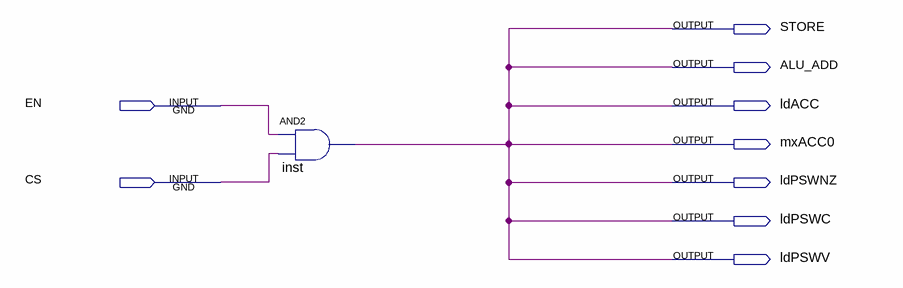
[diagram p0: schematic sheet]
// Quartus schematic ADD.bdf as structural Verilog: 1 symbols, 9 pins
module ADD (
  input  EN,
  input  CS,
  output STORE,
  output ALU_ADD,
  output ldACC,
  output mxACC0,
  output ldPSWNZ,
  output ldPSWC,
  output ldPSWV
);

  and inst (ALU_ADD, EN, CS);

  assign ldACC = ALU_ADD;
  assign ldPSWC = ALU_ADD;
  assign ldPSWNZ = ALU_ADD;
  assign ldPSWV = ALU_ADD;
  assign mxACC0 = ALU_ADD;
  assign STORE = ALU_ADD;
endmodule
